# EasyEDA schematic Apollon_ML_testing.json
TITLE: Sheet_1; REV: 1.0; Date: 2025-12-28; Sheet: 1/1; Drawn By: arthurtouati92; Company: Your Company
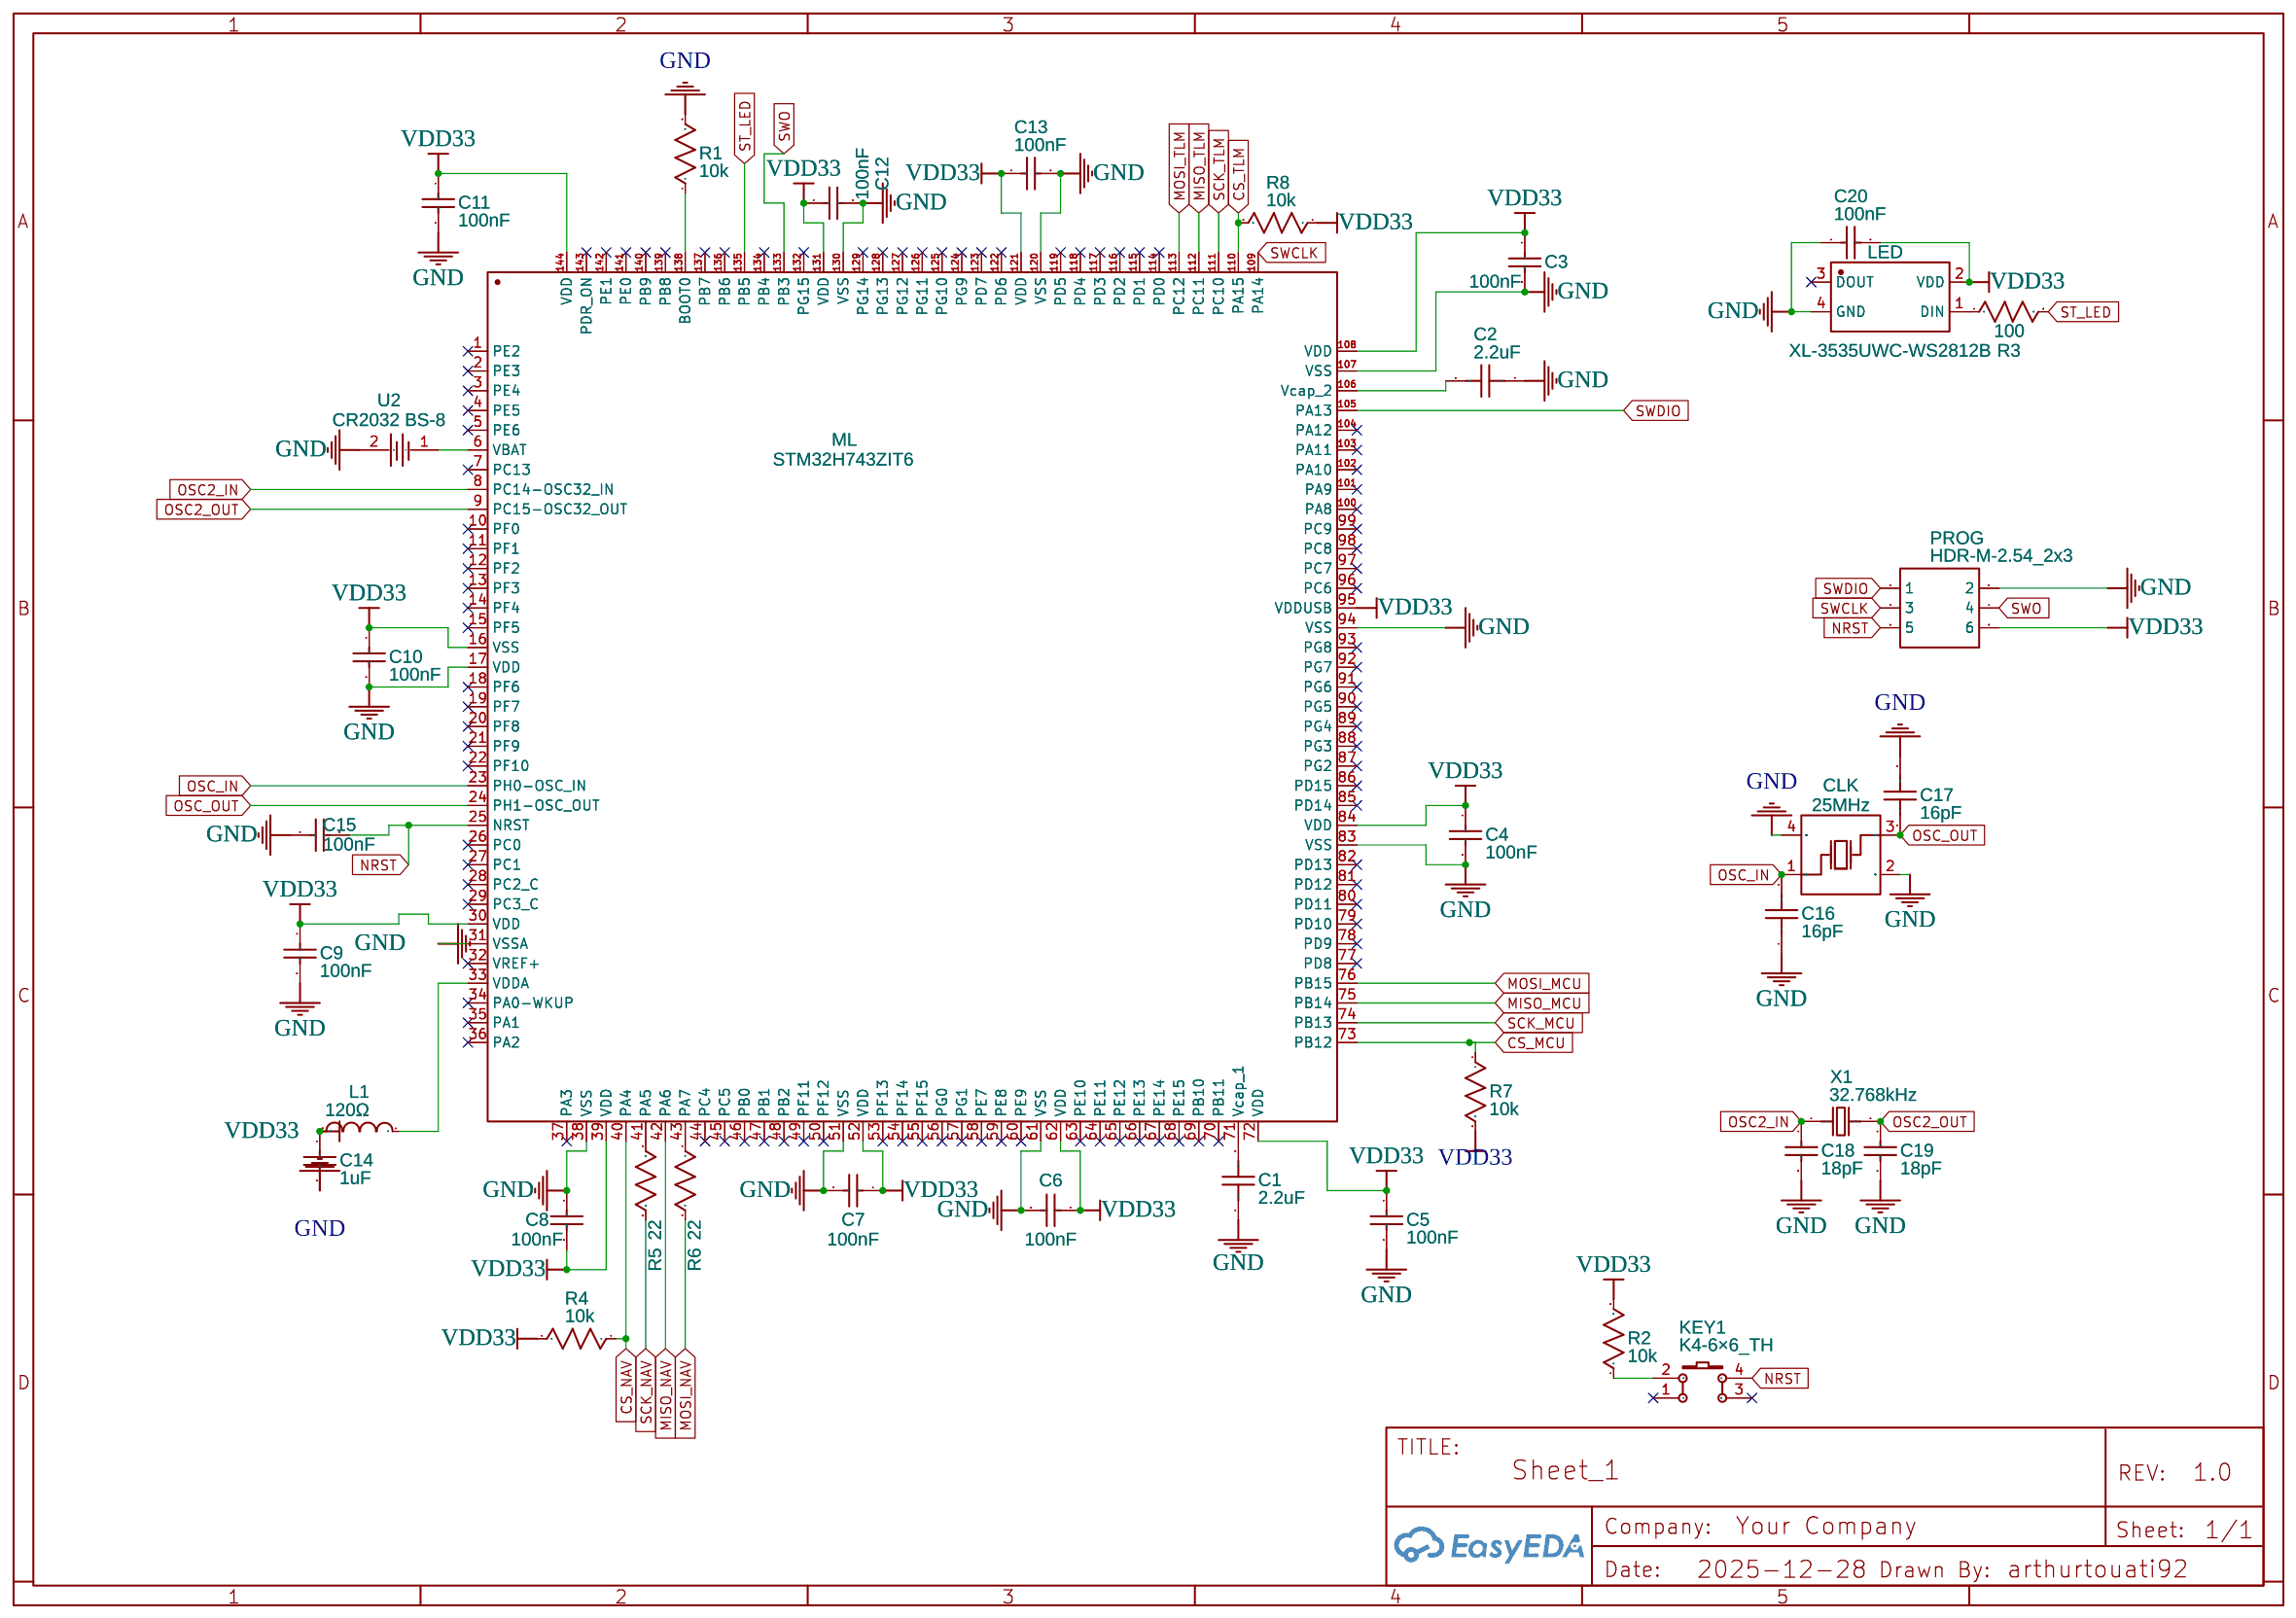
[diagram p0: schematic sheet]

## Parts
C1  2.2uF  [C0201]
C2  2.2uF  [C0201]
C3  100nF  [C0201]
C4  100nF  [C0201]
C5  100nF  [C0201]
C6  100nF  [C0201]
C7  100nF  [C0201]
C8  100nF  [C0201]
C9  100nF  [C0201]
C10  100nF  [C0201]
C11  100nF  [C0201]
C12  100nF  [C0201]
C13  100nF  [C0201]
C14  1uF  [C0201]
C15  100nF  [C0201]
C16  16pF  [C0402]
C17  16pF  [C0402]
C18  18pF  [C0201]
C19  18pF  [C0201]
C20  100nF  [C0201]
CLK  25MHz  [CRYSTAL-SMD_4P-L3.2-W2.5-BL]
KEY1  K4-6×6_TH  [KEY-TH_4P-L6.0-W6.0-P4.50-LS6.5]
L1  120Ω  [L0201]
LED  XL-3535UWC-WS2812B  [LED-SMD_XL-3535RGBC-WS2812B]
ML  STM32H743ZIT6  [LQFP-144_L20.0-W20.0-P0.50-LS22.0-BL]
PROG  HDR-M-2.54_2x3  [HDR-M-2.54_2X3]
R1  10k  [R0201]
R2  10k  [R0201]
R3  100  [R0201]
R4  10k  [R0201]
R5  22  [R0201]
R6  22  [R0201]
R7  10k  [R0201]
R8  10k  [R0201]
U2  CR2032 BS-8  [BAT-SMD_CR2032-BS-8]
X1  32.768kHz  [OSC-SMD_L3.2-W1.5]

## Library data of the parts
C1 C2 = CL03A225MP3CRNC: Contributor: LCSC; Supplier: LCSC; Supplier Part: C318539; Manufacturer: SAMSUNG(三星); JLCPCB Part Class: Extended Part
C3-C13 C15 C18-C20 = GRM033R61A104KE15D: Supplier: LCSC; Manufacturer: muRata(村田); Supplier Part: C76934; JLCPCB Part Class: Extended Part
C14 = CL03A105MQ3CSNH: Supplier: LCSC; Manufacturer: SAMSUNG(三星); Supplier Part: C53067; JLCPCB Part Class: Extended Part
C16 C17 = GRM1555C1H160JA01D: Supplier: LCSC; Manufacturer: muRata(村田); Supplier Part: C85936; JLCPCB Part Class: Extended Part
CLK = ABM8AIG-25.000MHZ-12-2Z-T3: Contributor: LCSC; Supplier: LCSC; Supplier Part: C1985412; Manufacturer: ABRACON; JLCPCB Part Class: Extended Part
KEY1 = K4-6×6_TH: Supplier: LCSC; Supplier Part: C136684; Manufacturer: 韩国韩荣; Manufacturer Part: K2-1102DP-E4SW-04; Contributor: LCEDA_Lib
L1 = BLM03AG121SN1D: Supplier: LCSC; Manufacturer: muRata(村田); Supplier Part: C97850; JLCPCB Part Class: Extended Part
LED = XL-3535UWC-WS2812B: Supplier: LCSC; Supplier Part: C51900947; Manufacturer: XINGLIGHT(成兴光); Manufacturer Part: XL-3535UWC-2812B; JLCPCB Part Class: Extended Part; Contributor: lcsc
ML = STM32H743ZIT6: Contributor: LCSC; Supplier: LCSC; Manufacturer: ST(意法半导体); Supplier Part: C114408; JLCPCB Part Class: Extended Part
PROG = HDR-M-2.54_2x3: Supplier Part: C65114; Supplier: LCSC; Contributor: LCEDA_Lib
R1-R8 = R_0201_US: Contributor: LCEDA_Lib
U2 = CR2032 BS-8: Supplier: LCSC; Supplier Part: C9900110766; Manufacturer: null; Contributor: lcsc; Convert to PCB: Yes; Add into BOM: Yes; JLCPCB Part Class: Extended Part
X1 = SC-32S32.768kHz20PPM12.5pF: Supplier: LCSC; Manufacturer: Seiko(精工); Supplier Part: C97606; JLCPCB Part Class: Extended Part

## Nets
GND: C1.1 C2.1 C3.2 C4.2 C5.2 C6.2 C7.2 C8.1 C9.2 C10.2 C11.2 C12.2 C13.2 C14.2 C15.2 C16.1 C17.2 C18.2 C19.2 C20.1 CLK.2(GND) CLK.4(GND) LED.4(GND) ML.17(VDD) ML.31(VSSA) ML.38(VSS) ML.51(VSS) ML.61(VSS) ML.83(VSS) ML.94(VSS) ML.107(VSS) ML.120(VSS) ML.130(VSS) PROG.2 R1.2 U2.2(+)
VDD33: C3.1 C4.1 C5.1 C6.1 C7.1 C8.2 C9.1 C10.1 C11.1 C12.1 C13.1 C14.1 C20.2 L1.2 LED.2(VDD) ML.16(VSS) ML.30(VDD) ML.39(VDD) ML.52(VDD) ML.62(VDD) ML.72(VDD) ML.84(VDD) ML.95(VDDUSB) ML.108(VDD) ML.121(VDD) ML.131(VDD) ML.144(VDD) PROG.6 R2.2 R4.2 R7.2 R8.1
CS_MCU: ML.73(PB12) R7.1
CS_NAV: ML.40(PA4) R4.1
CS_TLM: ML.110(PA15) R8.2
MISO_MCU: ML.75(PB14)
MISO_NAV: ML.42(PA6)
MISO_TLM: ML.112(PC11)
MOSI_MCU: ML.76(PB15)
MOSI_NAV: R6.2
MOSI_TLM: ML.113(PC12)
NRST: C15.1 KEY1.4 ML.25(NRST) PROG.5
OSC2_IN: C18.1 ML.8(PC14-OSC32_IN) X1.1
OSC2_OUT: C19.1 ML.9(PC15-OSC32_OUT) X1.2
OSC_IN: C16.2 CLK.1(OSC1) ML.23(PH0-OSC_IN)
OSC_OUT: C17.1 CLK.3(OSC2) ML.24(PH1-OSC_OUT)
SCK_MCU: ML.74(PB13)
SCK_NAV: R5.2
SCK_TLM: ML.111(PC10)
ST_LED: ML.135(PB5) R3.2
SWCLK: ML.109(PA14) PROG.3
SWDIO: ML.105(PA13) PROG.1
SWO: ML.133(PB3) PROG.4
Net-(C1-2): C1.2 ML.71(Vcap_1)
Net-(C2-2): C2.2 ML.106(Vcap_2)
Net-(KEY1-2): KEY1.2 R2.1
Net-(L1-1): L1.1 ML.33(VDDA)
Net-(LED-1): LED.1(DIN) R3.1
Net-(ML-6): ML.6(VBAT) U2.1(-)
Net-(ML-41): ML.41(PA5) R5.1
Net-(ML-43): ML.43(PA7) R6.1
Net-(ML-138): ML.138(BOOT0) R1.1

Not connected (* = marked no-connect by the designer): KEY1 1* 3*; LED 3(DOUT)*; ML 1(PE2)* 2(PE3)* 3(PE4)* 4(PE5)* 5(PE6)* 7(PC13)* 10(PF0)* 11(PF1)* 12(PF2)* 13(PF3)* 14(PF4)* 15(PF5)* 18(PF6)* 19(PF7)* 20(PF8)* 21(PF9)* 22(PF10)* 26(PC0)* 27(PC1)* 28(PC2_C)* 29(PC3_C)* 32(VREF+)* 34(PA0-WKUP)* 35(PA1)* 36(PA2)* 37(PA3)* 44(PC4)* 45(PC5)* 46(PB0)* 47(PB1)* 48(PB2)* 49(PF11)* 50(PF12)* 53(PF13)* 54(PF14)* 55(PF15)* 56(PG0)* 57(PG1)* 58(PE7)* 59(PE8)* 60(PE9)* 63(PE10)* 64(PE11)* 65(PE12)* 66(PE13)* 67(PE14)* 68(PE15)* 69(PB10)* 70(PB11)* 77(PD8)* 78(PD9)* 79(PD10)* 80(PD11)* 81(PD12)* 82(PD13)* 85(PD14)* 86(PD15)* 87(PG2)* 88(PG3)* 89(PG4)* 90(PG5)* 91(PG6)* 92(PG7)* 93(PG8)* 96(PC6)* 97(PC7)* 98(PC8)* 99(PC9)* 100(PA8)* 101(PA9)* 102(PA10)* 103(PA11)* 104(PA12)* 114(PD0)* 115(PD1)* 116(PD2)* 117(PD3)* 118(PD4)* 119(PD5)* 122(PD6)* 123(PD7)* 124(PG9)* 125(PG10)* 126(PG11)* 127(PG12)* 128(PG13)* 129(PG14)* 132(PG15)* 134(PB4)* 136(PB6)* 137(PB7)* 139(PB8)* 140(PB9)* 141(PE0)* 142(PE1)* 143(PDR_ON)*
